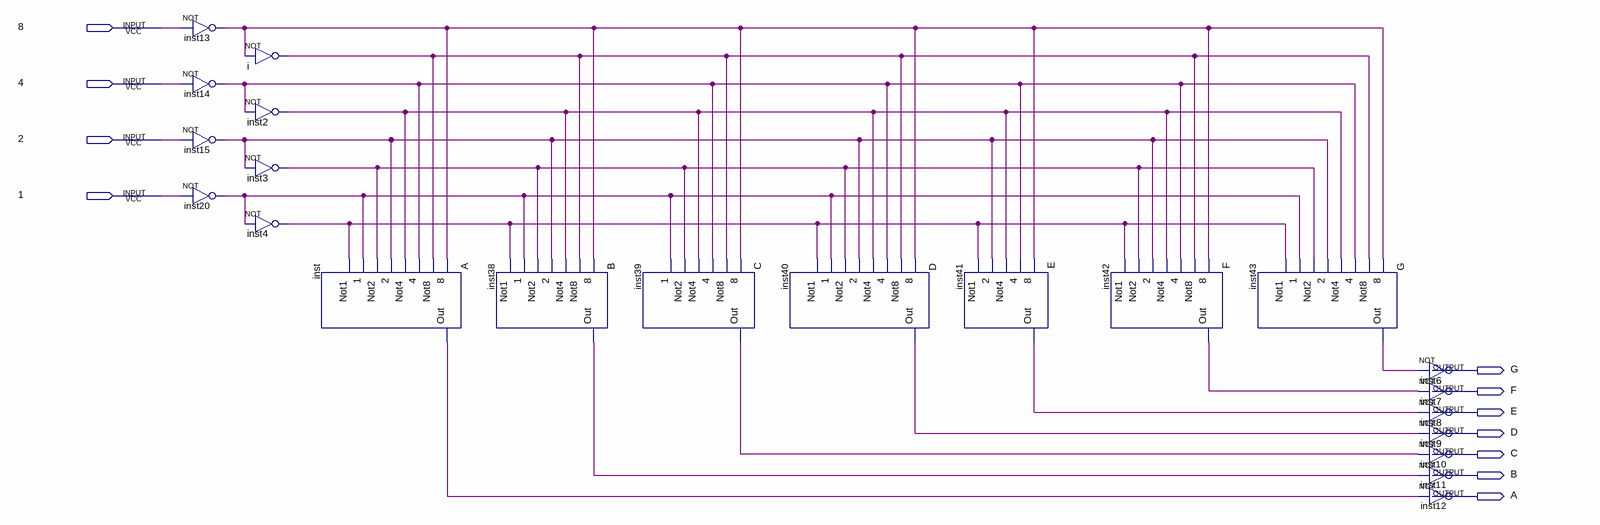
[diagram p0: schematic sheet]
// Quartus schematic bin_to_hex.bdf as structural Verilog: 22 symbols, 11 pins
module bin_to_hex (
  input  \8 ,
  input  \4 ,
  input  \2 ,
  input  \1 ,
  output G,
  output F,
  output E,
  output D,
  output C,
  output B,
  output A
);

  wire i_out, inst2_out, inst3_out, inst4_out, inst13_out, inst14_out, inst15_out, inst20_out, inst38_out,
       inst39_out, inst40_out, inst41_out, inst42_out, inst43_out, inst_out;

  not inst13 (inst13_out, \8 );
  not inst14 (inst14_out, \4 );
  not inst15 (inst15_out, \2 );
  not inst20 (inst20_out, \1 );
  not i (i_out, inst13_out);
  not inst2 (inst2_out, inst14_out);
  not inst3 (inst3_out, inst15_out);
  not inst4 (inst4_out, inst20_out);
  A inst (
    .\8 (inst13_out), .Not8(i_out), .\4 (inst14_out), .Not4(inst2_out), .\2 (inst15_out), .Not2(inst3_out),
    .\1 (inst20_out), .Not1(inst4_out), .Out(inst_out));
  B inst38 (
    .\8 (inst13_out), .Not8(i_out), .Not4(inst2_out), .\2 (inst15_out), .Not2(inst3_out), .\1 (inst20_out),
    .Not1(inst4_out), .Out(inst38_out));
  C inst39 (
    .\8 (inst13_out), .Not8(i_out), .\4 (inst14_out), .Not4(inst2_out), .Not2(inst3_out), .\1 (inst20_out),
    .Out(inst39_out));
  D inst40 (
    .\8 (inst13_out), .Not8(i_out), .\4 (inst14_out), .Not4(inst2_out), .\2 (inst15_out), .Not2(inst3_out),
    .\1 (inst20_out), .Not1(inst4_out), .Out(inst40_out));
  E inst41 (.\8 (inst13_out), .\4 (inst14_out), .Not4(inst2_out), .\2 (inst15_out), .Not1(inst4_out), .Out(inst41_out));
  F inst42 (
    .\8 (inst13_out), .Not8(i_out), .\4 (inst14_out), .Not4(inst2_out), .\2 (inst15_out), .Not2(inst3_out),
    .Not1(inst4_out), .Out(inst42_out));
  G inst43 (
    .\8 (inst13_out), .Not8(i_out), .\4 (inst14_out), .Not4(inst2_out), .\2 (inst15_out), .Not2(inst3_out),
    .\1 (inst20_out), .Not1(inst4_out), .Out(inst43_out));
  not inst6 (G, inst43_out);
  not inst7 (F, inst42_out);
  not inst8 (E, inst41_out);
  not inst9 (D, inst40_out);
  not inst10 (C, inst39_out);
  not inst11 (B, inst38_out);
  not inst12 (A, inst_out);
endmodule
